# Altium schematic sheet KC_BaseBoard4CompareTest-V0.2-XLR.SchDoc
size A4
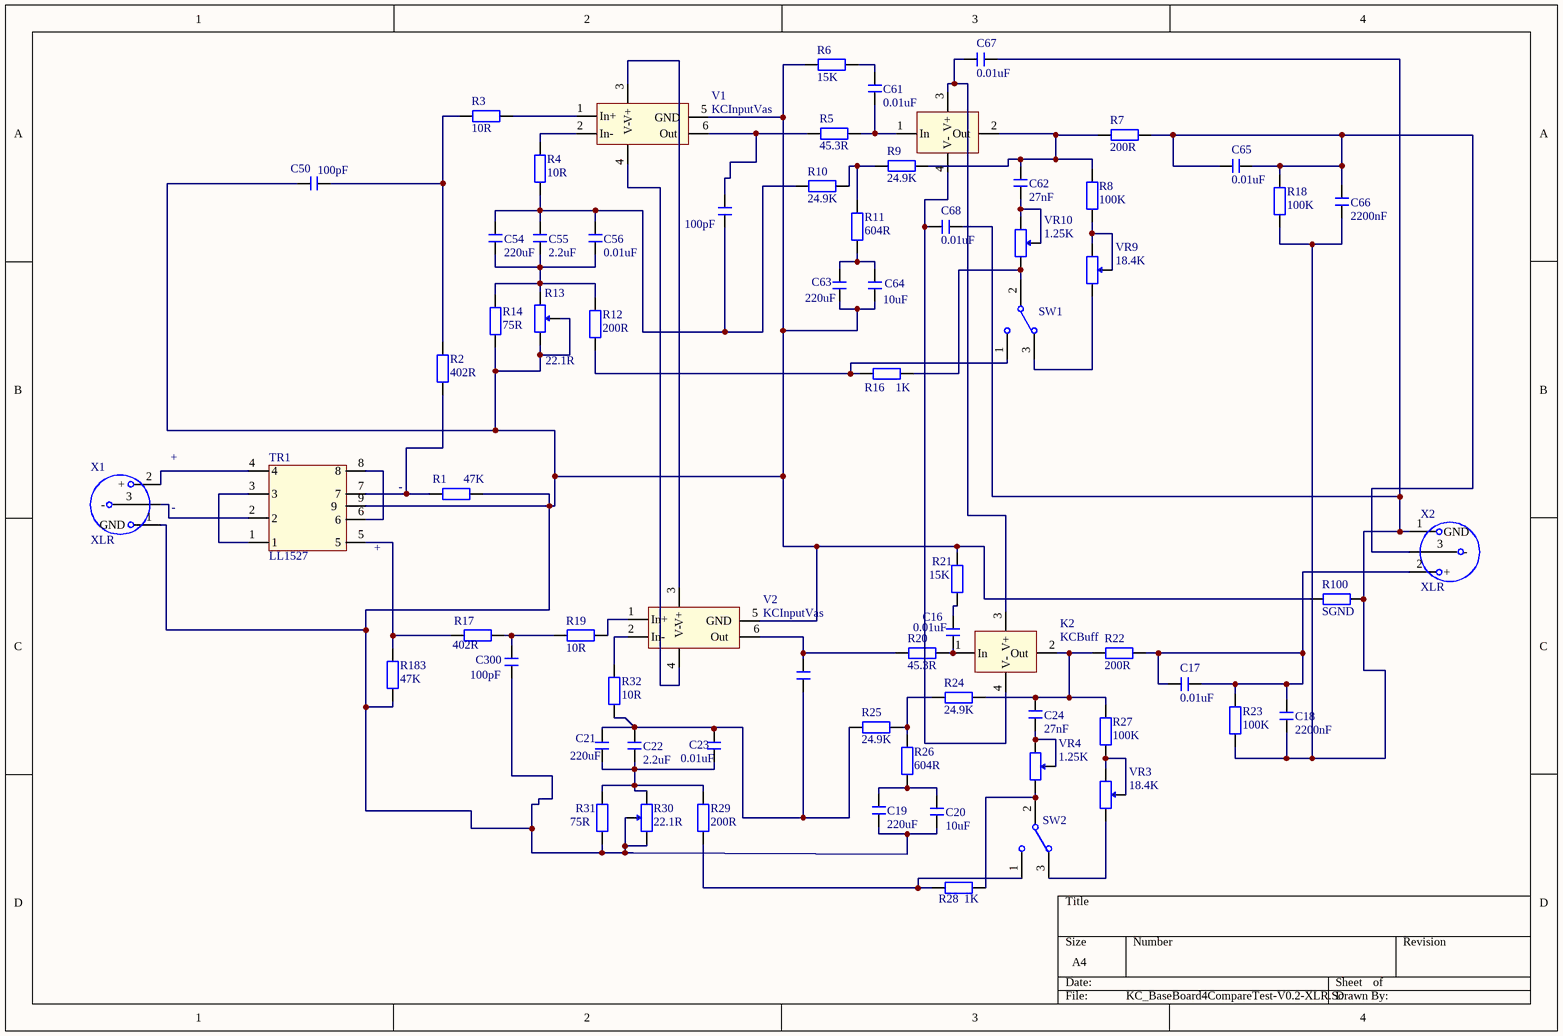
[diagram p0: KC_BaseBoard4CompareTest-V0.2-XLR.SchDoc]

## Parts
C16  0.01uF  [CBB 6.3*6.3*5]
C17  0.01uF  [CBB 6.3*6.3*5]
C18  2200nF  [CBB 6.3*6.3*5]
C19  220uF  [CBB 6.3*6.3*5]
C20  10uF  [CBB 6.3*6.3*5]
C21  220uF  [CBB 6.3*6.3*5]
C22  2.2uF  [CBB 6.3*6.3*5]
C23  0.01uF  [CBB 6.3*6.3*5]
C24  27nF  [CBB 6.3*6.3*5]
C50  100pF  [CBB 6.3*6.3*5]
C54  220uF  [CBB 6.3*6.3*5]
C55  2.2uF  [CBB 6.3*6.3*5]
C56  0.01uF  [CBB 6.3*6.3*5]
C60  100pF  [CBB 6.3*6.3*5]
C61  0.01uF  [CBB 6.3*6.3*5]
C62  27nF  [CBB 6.3*6.3*5]
C63  220uF  [CBB 6.3*6.3*5]
C64  10uF  [CBB 6.3*6.3*5]
C65  0.01uF  [CBB 6.3*6.3*5]
C66  2200nF  [CBB 6.3*6.3*5]
C67  0.01uF  [CBB 6.3*6.3*5]
C68  0.01uF  [CBB 6.3*6.3*5]
C300  100pF  [CBB 6.3*6.3*5]
C403  100pF  [CBB 6.3*6.3*5]  (value not drawn)
K1  KCBuff  [KCBuff]  (value not drawn)
K2  KCBuff  [KCBuff_M4]
R1  47K  [RS 1/4W]
R2  402R  [RS 1/4W]
R3  10R  [RS 1/4W]
R4  10R  [RS 1/4W]
R5  45.3R  [RS 1/4W]
R6  15K  [RS 1/4W]
R7  200R  [RS 1/4W]
R8  100K  [RS 1/4W]
R9  24.9K  [RS 1/4W]
R10  24.9K  [RS 1/4W]
R11  604R  [RS 1/4W]
R12  200R  [RS 1/4W]
R13  22.1R  [RS 1/2W-VR]
R14  75R  [RS 1/4W]
R16  1K  [RS 1/4W]
R17  402R  [RS 1/4W]
R18  100K  [RS 1/4W]
R19  10R  [RS 1/4W]
R20  45.3R  [RS 1/4W]
R21  15K  [RS 1/4W]
R22  200R  [RS 1/4W]
R23  100K  [RS 1/4W]
R24  24.9K  [RS 1/4W]
R25  24.9K  [RS 1/4W]
R26  604R  [RS 1/4W]
R27  100K  [RS 1/4W]
R28  1K  [RS 1/4W]
R29  200R  [RS 1/4W]
R30  22.1R  [RS 1/2W-VR]
R31  75R  [RS 1/4W]
R32  10R  [RS 1/4W]
R100  SGND  [RS 1/4W]
R183  47K  [RS 1/4W]
SW1  SW-3P-2S  [SS-12D06]  (value not drawn)
SW2  SW-3P-2S  [SS-12D06]  (value not drawn)
TR1  LL1527  [LL1527]
V1  KCInputVas  [KCIn_VAS]
V2  KCInputVas  [KCIn_VAS]
VR3  18.4K  [RS 1/2W-VR]
VR4  1.25K  [RS 1/2W-VR]
VR9  18.4K  [RS 1/2W-VR]
VR10  1.25K  [RS 1/2W-VR]
X1  XLR  [XLR-Male]
X2  XLR  [XLR-Male]

## Nets
NetC16_1: C16.1 K2.1(In) R20.2
NetC16_2: C16.2 R21.1
NetC17_1: C17.1 C17.2 C18.1 R22.1 R23.1 X2.2(+)
NetC18_2: C18.2 C66.1 C67.2 C68.2 R18.1 R23.2 R100.2 X2.1(GND)
NetC19_1: C19.1 C20.1 R26.1
NetC19_2: C19.2 C20.2 C50.1 C63.1 C64.1 C300.1 R1.2 R6.2 R13.2 R13.3 R14.2 R21.2 R30.1 R30.3 R31.1 R100.1 R183.1 TR1.9 V1.5(GND) V2.5(GND) X1.1(GND)
NetC21_1: C21.1 C22.1 C23.1 C403.1 R25.1 R32.1
NetC21_2: C21.2 C22.2 C23.2 R29.2 R30.2 R31.2
NetC24_1: C24.1 K2.2(Out) R22.2 R24.2 R27.1
NetC24_2: C24.2 VR4.1 VR4.3
NetC50_2: C50.2 R2.2 R3.1
NetC54_1: C54.1 C55.1 C56.1 R12.1 R13.1 R14.1
NetC54_2: C54.2 C55.2 C56.2 C60.1 R4.1 R10.2
NetC60_2: C60.2 R5.1 V1.6(Out)
NetC61_1: C61.1 K1.1(In) R5.2
NetC61_2: C61.2 R6.1
NetC62_1: C62.1 VR10.1 VR10.3
NetC62_2: C62.2 K1.2(Out) R7.1 R8.2 R9.1
NetC63_2: C63.2 C64.2 R11.2
NetC65_1: C65.1 C65.2 C66.2 R7.2 R18.2 X2.3(-)
NetC67_1: C67.1 K1.3(V+) K2.3(V+)
NetC68_1: C68.1 K1.4(V-) K2.4(V-)
NetC300_2: C300.2 R17.2 R19.1
NetC403_2: C403.2 R20.1 V2.6(Out)
NetR1_1: R1.1 R2.1 TR1.7
NetR3_2: R3.2 V1.1(In+)
NetR4_2: R4.2 V1.2(In-)
NetR8_1: R8.1 VR9.1 VR9.3
NetR9_2: R9.2 R10.1 R11.1
NetR12_2: R12.2 R16.1 SW1.1
NetR16_2: R16.2 SW1.2 VR10.2
NetR17_1: R17.1 R183.2 TR1.5
NetR19_2: R19.2 V2.1(In+)
NetR24_1: R24.1 R25.2 R26.2
NetR27_2: R27.2 VR3.1 VR3.3
NetR28_1: R28.1 R29.1 SW2.1
NetR28_2: R28.2 SW2.2 VR4.2
NetR32_2: R32.2 V2.2(In-)
NetSW1_3: SW1.3 VR9.2
NetSW2_3: SW2.3 VR3.2
NetTR1_1: TR1.1 TR1.3
NetTR1_2: TR1.2 X1.3(-)
NetTR1_4: TR1.4 X1.2(+)
NetTR1_6: TR1.6 TR1.8
NetV1_3: V1.3(V+) V2.3(V+)
NetV1_4: V1.4(V-) V2.4(V-)

## Notes on the sheet
- (near X1) +
- (near X1) -
- -
- (near TR1) +

## Library data of the parts
C16-C24 C50 C54-C56 C60-C68 C300 C403 = C-CBB: CBB电容; 版权归属: 源创客; BOM名称: CBB电容; 学习资源: www.ooocke.com
K1 K2 = KCBuff: King Cello Buffer Stage
R1-R12 R14 R16-R29 R31 R32 R100 R183 = R-CRR: 直插色环电阻; BOM名称: 色环电阻; 版权归属: 源创客; 学习资源: www.ooocke.com
R13 R30 VR3 VR4 VR9 VR10 = VR-W: 直插可调电阻-顶调
SW1 SW2 = SW-3P-2S: 3 Pin 2 Switch
TR1 = LL1527: Lundahl LL1527
V1 V2 = KCInputVas: King Cello Input Stage and VAS
X1 X2 = XLR: 3 Pin XLR